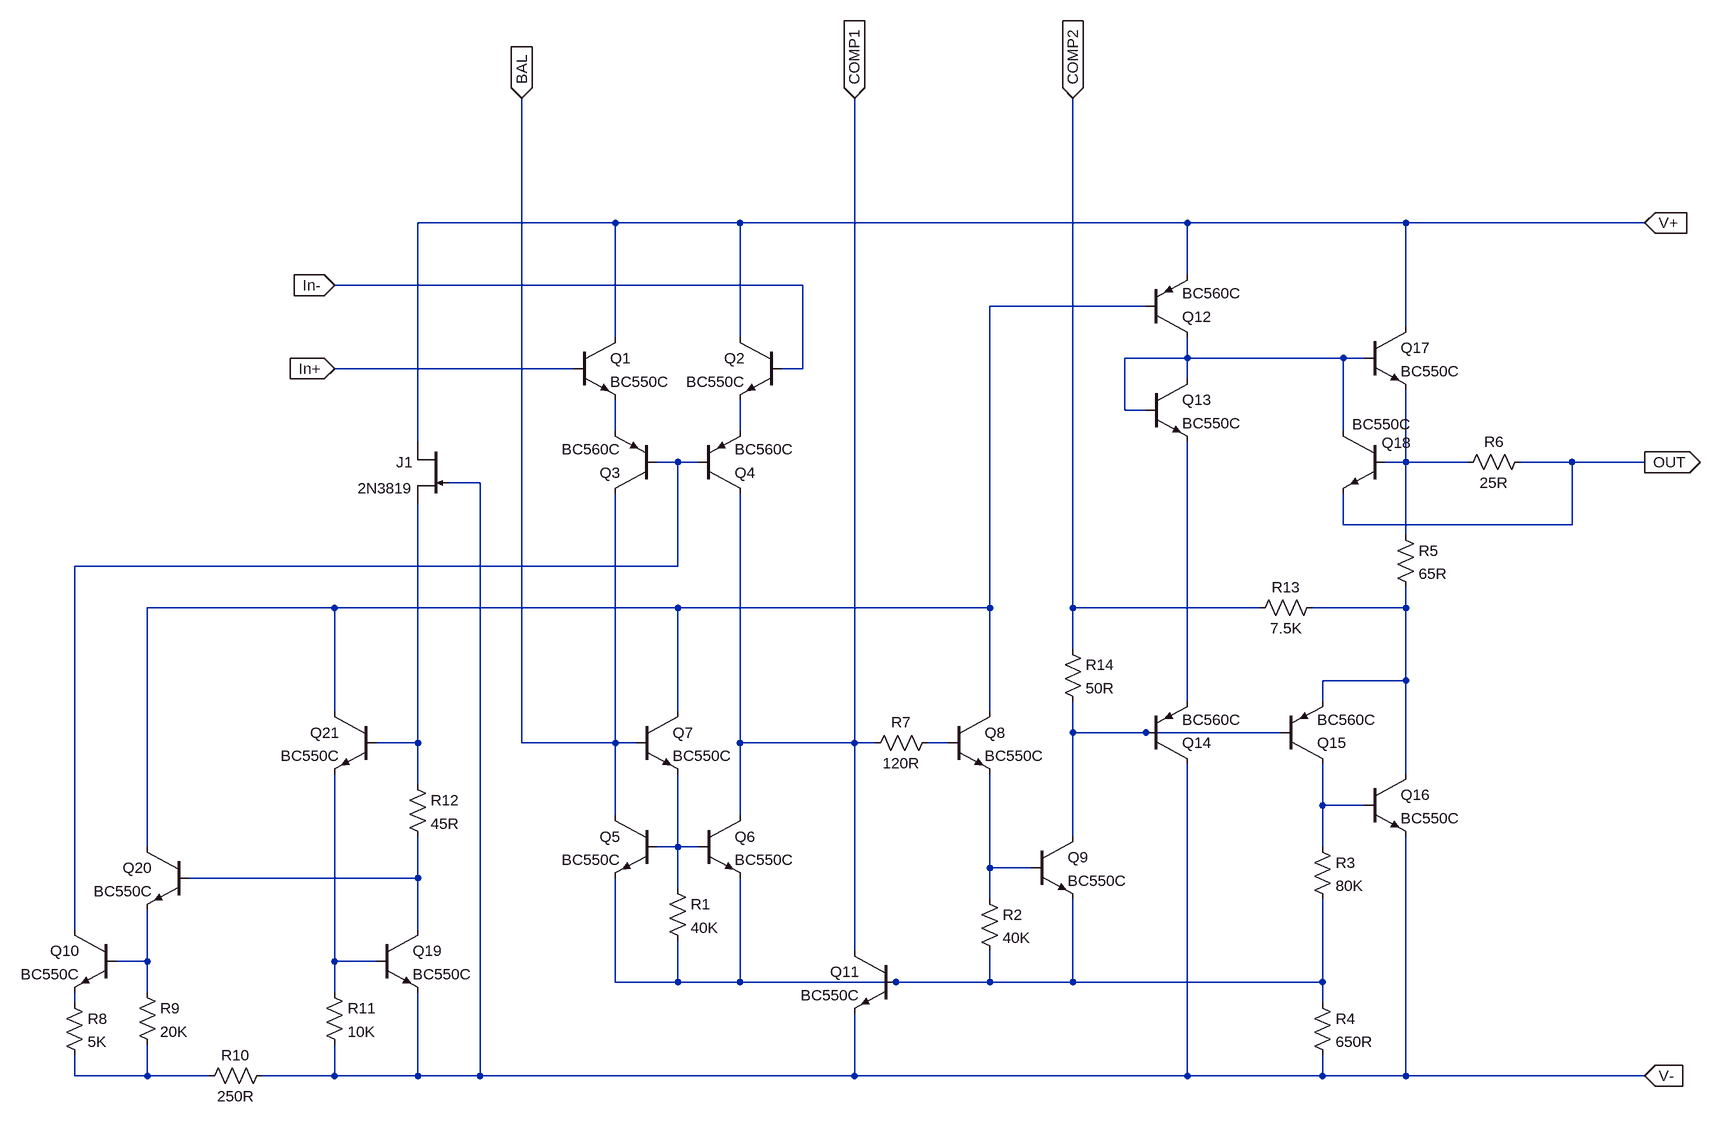
[diagram p0: schematic LM301.asc]
LM301.asc, the LTspice schematic file:
Version 4
SHEET 1 3316 1512
WIRE 1616 128 1312 128
WIRE 1808 128 1616 128
WIRE 2496 128 1808 128
WIRE 2832 128 2496 128
WIRE 3200 128 2832 128
WIRE 2496 208 2496 128
WIRE 1904 224 1184 224
WIRE 2432 256 2192 256
WIRE 2832 288 2832 128
WIRE 1616 304 1616 128
WIRE 1808 304 1808 128
WIRE 2496 336 2496 304
WIRE 2496 336 2400 336
WIRE 2736 336 2496 336
WIRE 2768 336 2736 336
WIRE 1552 352 1184 352
WIRE 1904 352 1904 224
WIRE 1904 352 1872 352
WIRE 2496 368 2496 336
WIRE 2400 416 2400 336
WIRE 2432 416 2400 416
WIRE 1616 448 1616 400
WIRE 1808 448 1808 400
WIRE 2736 448 2736 336
WIRE 1312 464 1312 128
WIRE 1712 496 1680 496
WIRE 1744 496 1712 496
WIRE 2832 496 2832 384
WIRE 2832 496 2800 496
WIRE 2928 496 2832 496
WIRE 3088 496 3008 496
WIRE 3200 496 3088 496
WIRE 1408 528 1360 528
WIRE 2736 592 2736 544
WIRE 3088 592 3088 496
WIRE 3088 592 2736 592
WIRE 2832 608 2832 496
WIRE 1712 656 1712 496
WIRE 1712 656 784 656
WIRE 1184 720 896 720
WIRE 1712 720 1184 720
WIRE 2192 720 2192 256
WIRE 2192 720 1712 720
WIRE 2320 720 2320 -64
WIRE 2608 720 2320 720
WIRE 2832 720 2832 688
WIRE 2832 720 2688 720
WIRE 2320 784 2320 720
WIRE 2832 832 2832 720
WIRE 2832 832 2704 832
WIRE 2496 864 2496 464
WIRE 2704 864 2704 832
WIRE 1184 880 1184 720
WIRE 1712 880 1712 720
WIRE 2192 880 2192 720
WIRE 2320 912 2320 864
WIRE 2432 912 2320 912
WIRE 2640 912 2432 912
WIRE 1312 928 1312 560
WIRE 1312 928 1248 928
WIRE 1472 928 1472 -64
WIRE 1616 928 1616 544
WIRE 1616 928 1472 928
WIRE 1648 928 1616 928
WIRE 1808 928 1808 544
WIRE 1984 928 1984 -64
WIRE 1984 928 1808 928
WIRE 2016 928 1984 928
WIRE 2128 928 2096 928
WIRE 2832 976 2832 832
WIRE 1312 992 1312 928
WIRE 2704 1024 2704 960
WIRE 2768 1024 2704 1024
WIRE 1616 1040 1616 928
WIRE 1808 1040 1808 928
WIRE 2320 1072 2320 912
WIRE 896 1088 896 720
WIRE 1712 1088 1712 976
WIRE 1712 1088 1680 1088
WIRE 1744 1088 1712 1088
WIRE 2704 1088 2704 1024
WIRE 2192 1120 2192 976
WIRE 2256 1120 2192 1120
WIRE 1312 1136 1312 1072
WIRE 1312 1136 960 1136
WIRE 1712 1152 1712 1088
WIRE 2192 1168 2192 1120
WIRE 784 1216 784 656
WIRE 1312 1216 1312 1136
WIRE 1984 1248 1984 928
WIRE 896 1264 896 1184
WIRE 896 1264 848 1264
WIRE 1184 1264 1184 976
WIRE 1248 1264 1184 1264
WIRE 1616 1296 1616 1136
WIRE 1712 1296 1712 1232
WIRE 1712 1296 1616 1296
WIRE 1808 1296 1808 1136
WIRE 1808 1296 1712 1296
WIRE 2048 1296 1808 1296
WIRE 2192 1296 2192 1248
WIRE 2192 1296 2048 1296
WIRE 2320 1296 2320 1168
WIRE 2320 1296 2192 1296
WIRE 2704 1296 2704 1168
WIRE 2704 1296 2320 1296
WIRE 896 1312 896 1264
WIRE 1184 1312 1184 1264
WIRE 784 1328 784 1312
WIRE 2704 1328 2704 1296
WIRE 784 1440 784 1408
WIRE 896 1440 896 1392
WIRE 896 1440 784 1440
WIRE 992 1440 896 1440
WIRE 1184 1440 1184 1392
WIRE 1184 1440 1072 1440
WIRE 1312 1440 1312 1312
WIRE 1312 1440 1184 1440
WIRE 1408 1440 1408 528
WIRE 1408 1440 1312 1440
WIRE 1984 1440 1984 1344
WIRE 1984 1440 1408 1440
WIRE 2496 1440 2496 960
WIRE 2496 1440 1984 1440
WIRE 2704 1440 2704 1408
WIRE 2704 1440 2496 1440
WIRE 2832 1440 2832 1072
WIRE 2832 1440 2704 1440
WIRE 3200 1440 2832 1440
FLAG 1472 -64 BAL
IOPIN 1472 -64 In
FLAG 1984 -64 COMP1
IOPIN 1984 -64 In
FLAG 2320 -64 COMP2
IOPIN 2320 -64 In
FLAG 1184 352 In+
IOPIN 1184 352 In
FLAG 1184 224 In-
IOPIN 1184 224 In
FLAG 3200 128 V+
IOPIN 3200 128 In
FLAG 3200 1440 V-
IOPIN 3200 1440 In
FLAG 3200 496 OUT
IOPIN 3200 496 Out
SYMBOL npn 1552 304 R0
SYMATTR InstName Q1
SYMATTR Value BC550C
SYMBOL npn 1872 304 M0
SYMATTR InstName Q2
SYMATTR Value BC550C
SYMBOL pnp 1680 544 R180
SYMATTR InstName Q3
SYMATTR Value BC560C
SYMBOL pnp 1744 544 M180
SYMATTR InstName Q4
SYMATTR Value BC560C
SYMBOL npn 1680 1040 M0
SYMATTR InstName Q5
SYMATTR Value BC550C
SYMBOL npn 1744 1040 R0
SYMATTR InstName Q6
SYMATTR Value BC550C
SYMBOL npn 1648 880 R0
SYMATTR InstName Q7
SYMATTR Value BC550C
SYMBOL res 1696 1136 R0
SYMATTR InstName R1
SYMATTR Value 40K
SYMATTR SpiceLine tol=1 pwr=0.25
SYMBOL npn 2128 880 R0
SYMATTR InstName Q8
SYMATTR Value BC550C
SYMBOL npn 2256 1072 R0
SYMATTR InstName Q9
SYMATTR Value BC550C
SYMBOL res 2176 1152 R0
SYMATTR InstName R2
SYMATTR Value 40K
SYMATTR SpiceLine tol=1 pwr=0.25
SYMBOL npn 848 1216 M0
SYMATTR InstName Q10
SYMATTR Value BC550C
SYMBOL npn 2048 1248 M0
SYMATTR InstName Q11
SYMATTR Value BC550C
SYMBOL pnp 2432 304 M180
SYMATTR InstName Q12
SYMATTR Value BC560C
SYMBOL npn 2432 368 R0
SYMATTR InstName Q13
SYMATTR Value BC550C
SYMBOL pnp 2432 960 M180
SYMATTR InstName Q14
SYMATTR Value BC560C
SYMBOL pnp 2640 960 M180
SYMATTR InstName Q15
SYMATTR Value BC560C
SYMBOL res 2688 1072 R0
SYMATTR InstName R3
SYMATTR Value 80K
SYMATTR SpiceLine tol=1 pwr=0.25
SYMBOL res 2688 1312 R0
SYMATTR InstName R4
SYMATTR Value 650R
SYMATTR SpiceLine tol=1 pwr=0.25
SYMBOL npn 2768 976 R0
SYMATTR InstName Q16
SYMATTR Value BC550C
SYMBOL npn 2768 288 R0
SYMATTR InstName Q17
SYMATTR Value BC550C
SYMBOL npn 2800 448 M0
WINDOW 0 -41 18 Left 2
WINDOW 3 -40 -10 Left 2
SYMATTR InstName Q18
SYMATTR Value BC550C
SYMBOL res 2816 592 R0
SYMATTR InstName R5
SYMATTR Value 65R
SYMATTR SpiceLine tol=1 pwr=0.25
SYMBOL res 3024 480 R90
WINDOW 0 0 56 VBottom 2
WINDOW 3 32 56 VTop 2
SYMATTR InstName R6
SYMATTR Value 25R
SYMATTR SpiceLine tol=1 pwr=0.25
SYMBOL res 2112 912 R90
WINDOW 0 0 56 VBottom 2
WINDOW 3 32 56 VTop 2
SYMATTR InstName R7
SYMATTR Value 120R
SYMATTR SpiceLine tol=1 pwr=0.25
SYMBOL res 768 1312 R0
SYMATTR InstName R8
SYMATTR Value 5K
SYMATTR SpiceLine tol=1 pwr=0.25
SYMBOL res 880 1296 R0
SYMATTR InstName R9
SYMATTR Value 20K
SYMATTR SpiceLine tol=1 pwr=0.25
SYMBOL res 1088 1424 R90
WINDOW 0 0 56 VBottom 2
WINDOW 3 32 56 VTop 2
SYMATTR InstName R10
SYMATTR Value 250R
SYMATTR SpiceLine tol=1 pwr=0.25
SYMBOL res 1168 1296 R0
SYMATTR InstName R11
SYMATTR Value 10K
SYMATTR SpiceLine tol=1 pwr=0.25
SYMBOL npn 1248 1216 R0
SYMATTR InstName Q19
SYMATTR Value BC550C
SYMBOL npn 960 1088 M0
SYMATTR InstName Q20
SYMATTR Value BC550C
SYMBOL res 1296 976 R0
SYMATTR InstName R12
SYMATTR Value 45R
SYMATTR SpiceLine tol=1 pwr=0.25
SYMBOL npn 1248 880 M0
SYMATTR InstName Q21
SYMATTR Value BC550C
SYMBOL njf 1360 464 M0
SYMATTR InstName J1
SYMATTR Value 2N3819
SYMBOL res 2704 704 R90
WINDOW 0 0 56 VBottom 2
WINDOW 3 32 56 VTop 2
SYMATTR InstName R13
SYMATTR Value 7.5K
SYMATTR SpiceLine tol=1 pwr=0.25
SYMBOL res 2304 768 R0
SYMATTR InstName R14
SYMATTR Value 50R
SYMATTR SpiceLine tol=1 pwr=0.25

The netlist it stands for:
* LM301.asc
Q1 V+ In+ N003 0 BC550C
Q2 V+ In- N004 0 BC550C
Q3 BAL N005 N003 0 BC560C
Q4 COMP1 N005 N004 0 BC560C
Q5 BAL N013 N018 0 BC550C
Q6 COMP1 N013 N018 0 BC550C
Q7 N001 BAL N013 0 BC550C
R1 N013 N018 40K tol=1 pwr=0.25
Q8 N001 N011 N014 0 BC550C
Q9 N009 N014 N018 0 BC550C
R2 N014 N018 40K tol=1 pwr=0.25
Q10 N005 N016 N019 0 BC550C
Q11 COMP1 N018 V- 0 BC550C
Q12 N002 N001 V+ 0 BC560C
Q13 N002 N002 N008 0 BC550C
Q14 V- N009 N008 0 BC560C
Q15 N012 N009 N007 0 BC560C
R3 N012 N018 80K tol=1 pwr=0.25
R4 N018 V- 650R tol=1 pwr=0.25
Q16 N007 N012 V- 0 BC550C
Q17 V+ N002 N006 0 BC550C
Q18 N002 N006 OUT 0 BC550C
R5 N006 N007 65R tol=1 pwr=0.25
R6 OUT N006 25R tol=1 pwr=0.25
R7 N011 COMP1 120R tol=1 pwr=0.25
R8 N019 N020 5K tol=1 pwr=0.25
R9 N016 N020 20K tol=1 pwr=0.25
R10 V- N020 250R tol=1 pwr=0.25
R11 N017 V- 10K tol=1 pwr=0.25
Q19 N015 N017 V- 0 BC550C
Q20 N001 N015 N016 0 BC550C
R12 N010 N015 45R tol=1 pwr=0.25
Q21 N001 N010 N017 0 BC550C
J1 V+ V- N010 2N3819
R13 N007 COMP2 7.5K tol=1 pwr=0.25
R14 COMP2 N009 50R tol=1 pwr=0.25
.model NPN NPN
.model PNP PNP
.lib standard.bjt
.model NJF NJF
.model PJF PJF
.lib standard.jft
.backanno
.end